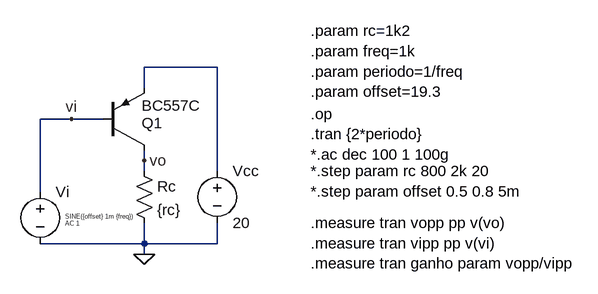
[diagram p0: schematic common_emitter_pnp_ex1.asc]
common_emitter_pnp_ex1.asc, the LTspice schematic file:
Version 4
SHEET 1 960 680
WIRE 288 32 176 32
WIRE 176 64 176 32
WIRE 64 112 16 112
WIRE 112 112 64 112
WIRE 176 176 176 160
WIRE 176 192 176 176
WIRE 288 192 288 32
WIRE 16 224 16 112
WIRE 176 304 176 272
WIRE 176 304 16 304
WIRE 288 304 288 272
WIRE 288 304 176 304
WIRE 176 320 176 304
FLAG 176 320 0
FLAG 176 176 vo
FLAG 64 112 vi
SYMBOL voltage 16 208 R0
WINDOW 3 38 54 Left 0
WINDOW 123 38 65 Left 0
WINDOW 39 0 0 Left 0
SYMATTR Value SINE({offset} 1m {freq})
SYMATTR Value2 AC 1
SYMATTR InstName Vi
SYMBOL res 160 176 R0
SYMATTR InstName Rc
SYMATTR Value {rc}
SYMBOL voltage 288 176 R0
WINDOW 123 0 0 Left 0
WINDOW 39 0 0 Left 0
SYMATTR InstName Vcc
SYMATTR Value 20
SYMBOL pnp 112 160 M180
WINDOW 0 60 42 Left 2
WINDOW 3 60 69 Left 2
SYMATTR InstName Q1
SYMATTR Value BC557C
TEXT 432 -24 Left 2 !.param rc=1k2\n.param freq=1k\n.param periodo=1/freq\n.param offset=19.3
TEXT 432 104 Left 2 !.op\n.tran {2*periodo}\n*.ac dec 100 1 100g
TEXT 432 272 Left 2 !.measure tran vopp pp v(vo)\n.measure tran vipp pp v(vi)\n.measure tran ganho param vopp/vipp
TEXT 432 192 Left 2 !*.step param rc 800 2k 20\n*.step param offset 0.5 0.8 5m

The netlist it stands for:
* common_emitter_pnp_ex1.asc
Vi vi 0 SINE({offset} 1m {freq}) AC 1
Rc vo 0 {rc}
Vcc N001 0 20
Q1 vo vi N001 0 BC557C
.model NPN NPN
.model PNP PNP
.lib standard.bjt
.param rc=1k2
.param freq=1k
.param periodo=1/freq
.param offset=19.3
.op
.tran {2*periodo}
*.ac dec 100 1 100g
.measure tran vopp pp v(vo)
.measure tran vipp pp v(vi)
.measure tran ganho param vopp/vipp
*.step param rc 800 2k 20
*.step param offset 0.5 0.8 5m
.backanno
.end